# Altium schematic sheet display.SchDoc
size A4; SheetNumber: 4; SheetTotal: 4
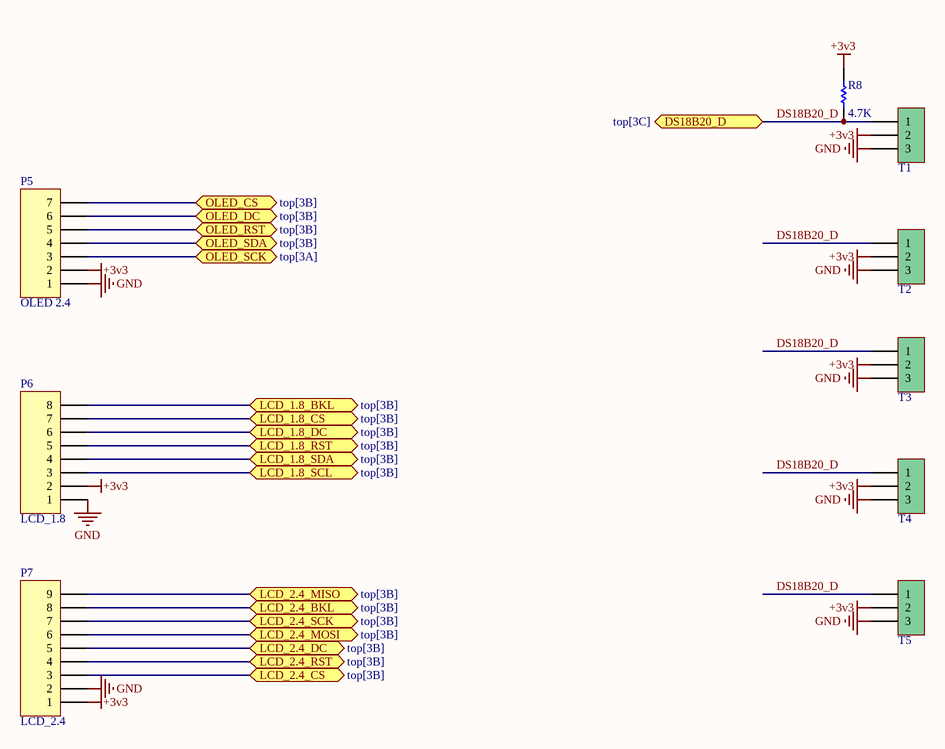
[diagram p0: display.SchDoc]

## Parts
P5  OLED 2.4  [HDR1X7]
P6  LCD_1.8  [HDR1X8]
P7  LCD_2.4  [HDR1X9]
R8  value 4.7K  [RES 0805 (2012X06L)]  (hidden comment: Res 4.7K)
T1  Phoenix terminal  [phoenix terminal 3]  (value not drawn)
T2  Phoenix terminal  [phoenix terminal 3]  (value not drawn)
T3  Phoenix terminal  [phoenix terminal 3]  (value not drawn)
T4  Phoenix terminal  [phoenix terminal 3]  (value not drawn)
T5  Phoenix terminal  [phoenix terminal 3]  (value not drawn)

## Ports
DS18B20_D (bidir, see top[3C]), LCD_1.8_BKL (bidir, see top[3B]), LCD_1.8_CS (bidir, see top[3B]), LCD_1.8_DC (bidir, see top[3B]), LCD_1.8_RST (bidir, see top[3B]), LCD_1.8_SCL (bidir, see top[3B]), LCD_1.8_SDA (bidir, see top[3B]), LCD_2.4_BKL (bidir, see top[3B]), LCD_2.4_CS (bidir, see top[3B]), LCD_2.4_DC (bidir, see top[3B]), LCD_2.4_MISO (bidir, see top[3B]), LCD_2.4_MOSI (bidir, see top[3B]), LCD_2.4_RST (bidir, see top[3B]), LCD_2.4_SCK (bidir, see top[3B]), OLED_CS (bidir, see top[3B]), OLED_DC (bidir, see top[3B]), OLED_RST (bidir, see top[3B]), OLED_SCK (bidir, see top[3A]), OLED_SDA (bidir, see top[3B])

## Nets
+3v3: P5.2 P6.2 P7.1 R8.2 T1.2 T2.2 T3.2 T4.2 T5.2
GND: P5.1 P6.1 P7.2 T1.3 T2.3 T3.3 T4.3 T5.3
DS18B20_D: R8.1 T1.1 T2.1 T3.1 T4.1 T5.1 ; port DS18B20_D
LCD_1.8_BKL: P6.8 ; port LCD_1.8_BKL
LCD_1.8_CS: P6.7 ; port LCD_1.8_CS
LCD_1.8_DC: P6.6 ; port LCD_1.8_DC
LCD_1.8_RST: P6.5 ; port LCD_1.8_RST
LCD_1.8_SCL: P6.3 ; port LCD_1.8_SCL
LCD_1.8_SDA: P6.4 ; port LCD_1.8_SDA
LCD_2.4_BKL: P7.8 ; port LCD_2.4_BKL
LCD_2.4_CS: P7.3 ; port LCD_2.4_CS
LCD_2.4_DC: P7.5 ; port LCD_2.4_DC
LCD_2.4_MISO: P7.9 ; port LCD_2.4_MISO
LCD_2.4_MOSI: P7.6 ; port LCD_2.4_MOSI
LCD_2.4_RST: P7.4 ; port LCD_2.4_RST
LCD_2.4_SCK: P7.7 ; port LCD_2.4_SCK
OLED_CS: P5.7 ; port OLED_CS
OLED_DC: P5.6 ; port OLED_DC
OLED_RST: P5.5 ; port OLED_RST
OLED_SCK: P5.3 ; port OLED_SCK
OLED_SDA: P5.4 ; port OLED_SDA

## Library data of the parts
P5 = Header 7: Header, 7-Pin; LatestRevisionDate: 17-Jul-2002; LatestRevisionNote: Re-released for DXP Platform.; Publisher: Altium Limited
P6 = Header 8: Header, 8-Pin; LatestRevisionDate: 17-Jul-2002; LatestRevisionNote: Re-released for DXP Platform.; Publisher: Altium Limited
P7 = Header 9: Header, 9-Pin; LatestRevisionDate: 17-Jul-2002; LatestRevisionNote: Re-released for DXP Platform.; Publisher: Altium Limited
R8 = Res1: Resistor; Published: 8-Jun-2000; LatestRevisionDate: 17-Jul-2002; LatestRevisionNote: Re-released for DXP Platform.; PackageReference: AXIAL-0.3; Publisher: Altium Limited; PackageDescription: Axial Device, Thru-Hole; 2 Leads; 0.3 in Pin Spacing
T1-T5 = Phoenix terminal 3: Terminal 3 Pin; Designer: Seyed Mohsen Ghasemain; E-mail: picpars@gmail.com; ComponentLinkURL: www.picpars.com